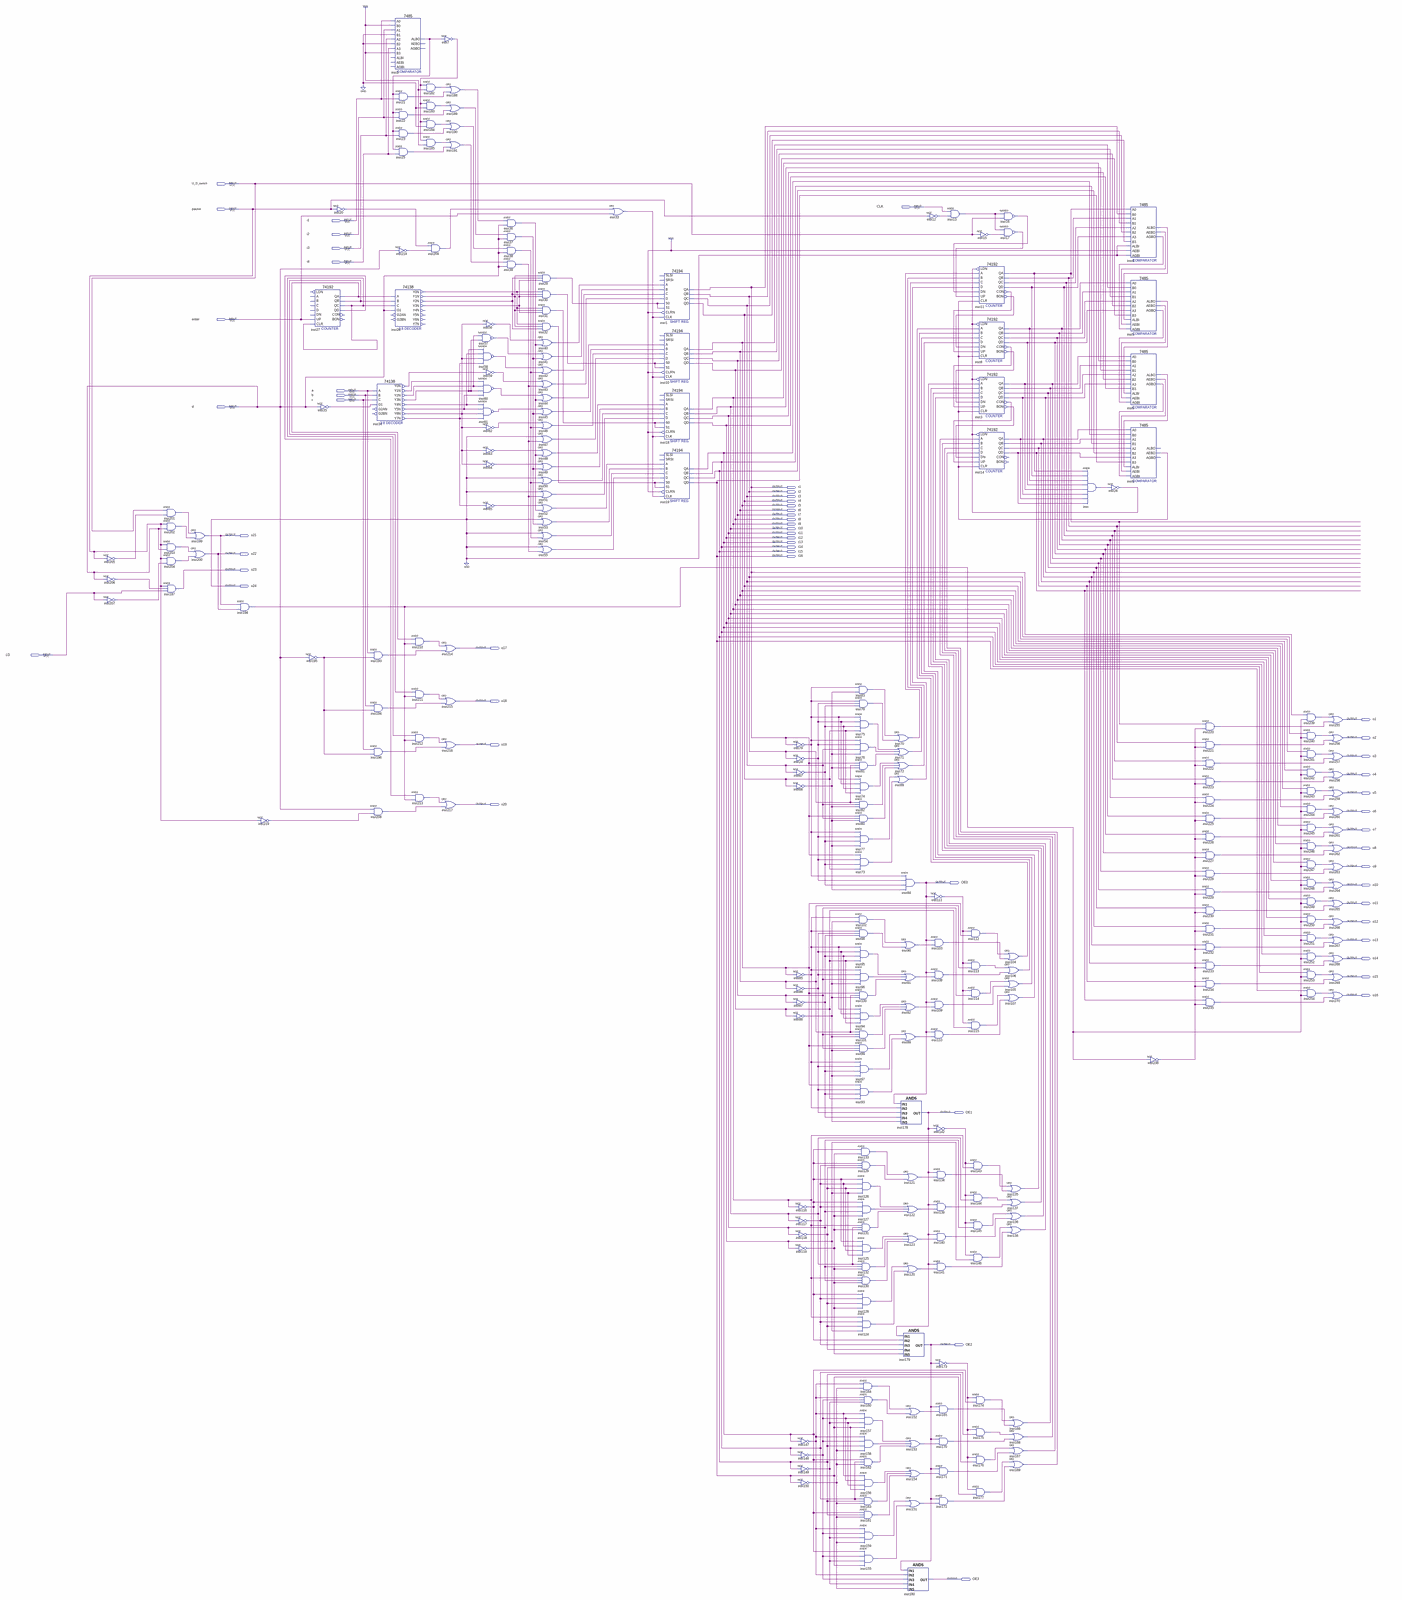
[diagram p0: schematic sheet, whole]
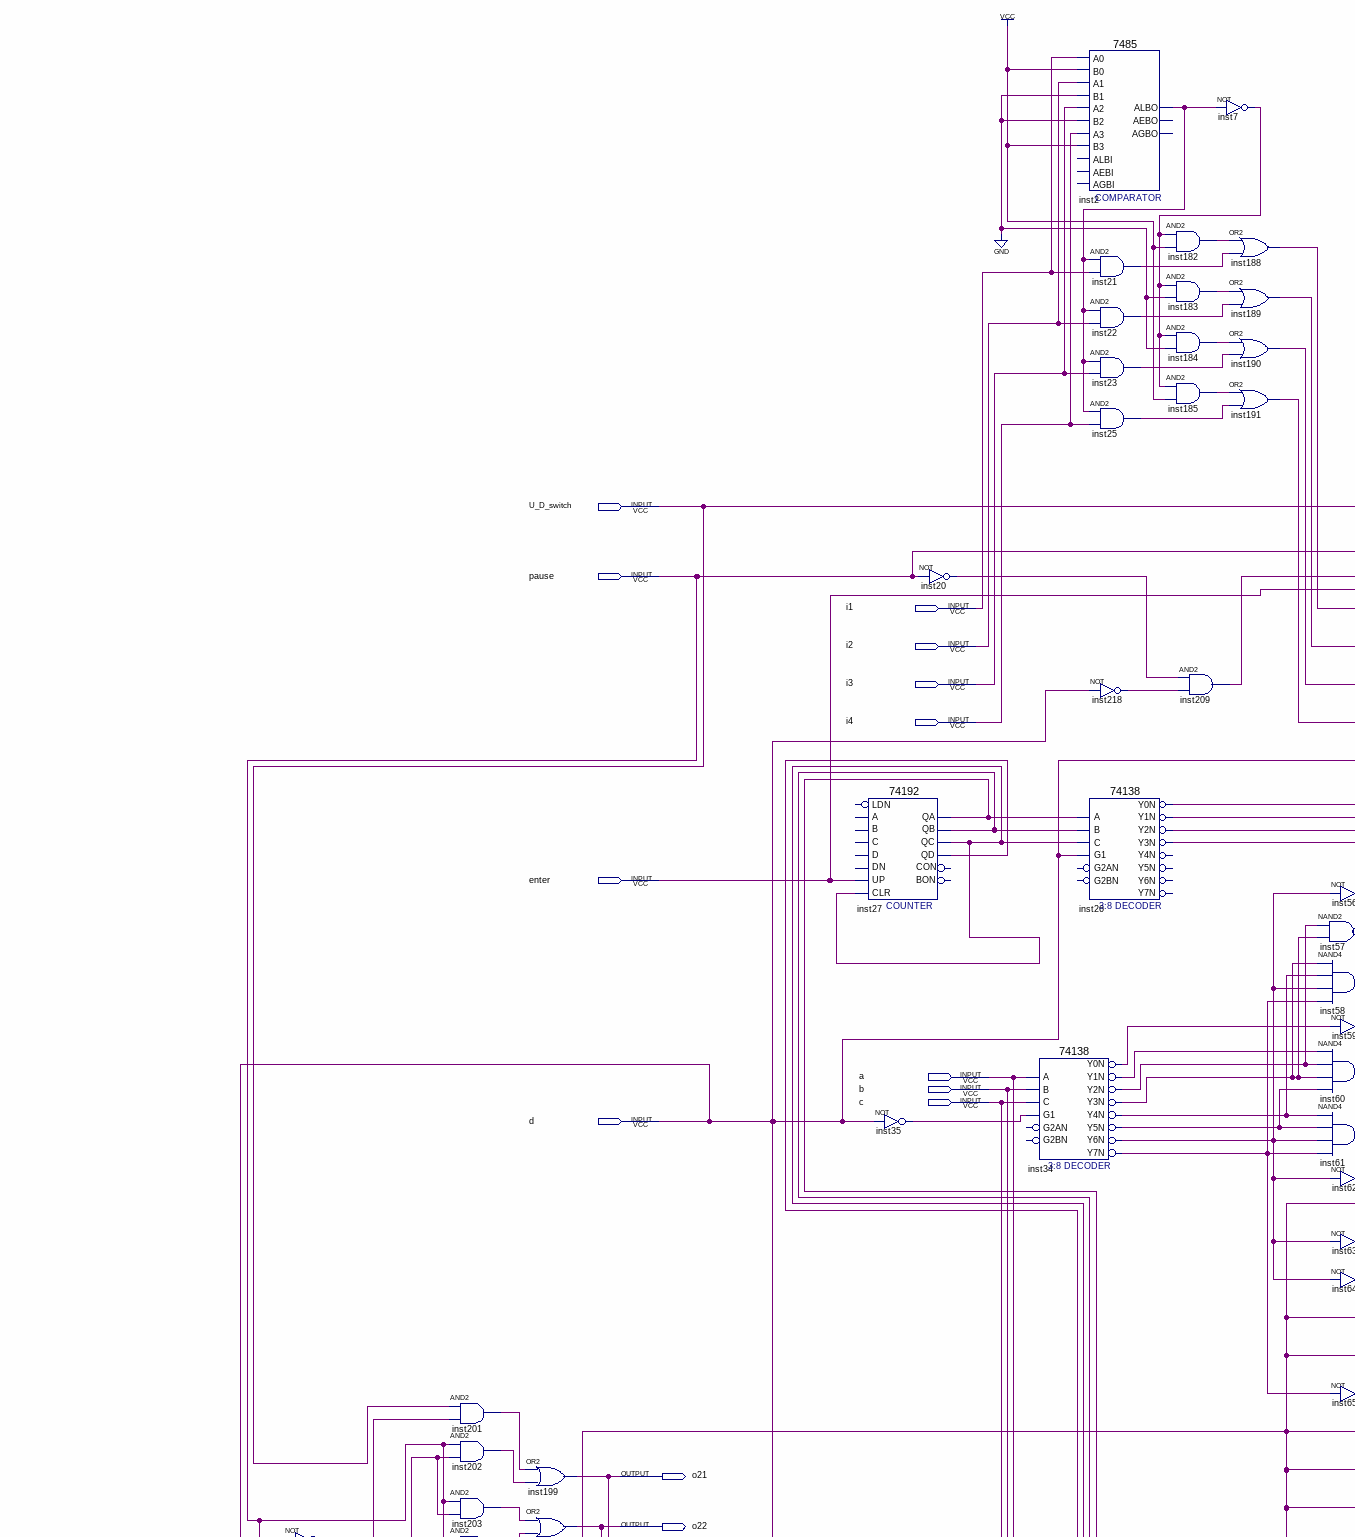
[diagram p1: schematic sheet, upper left part]
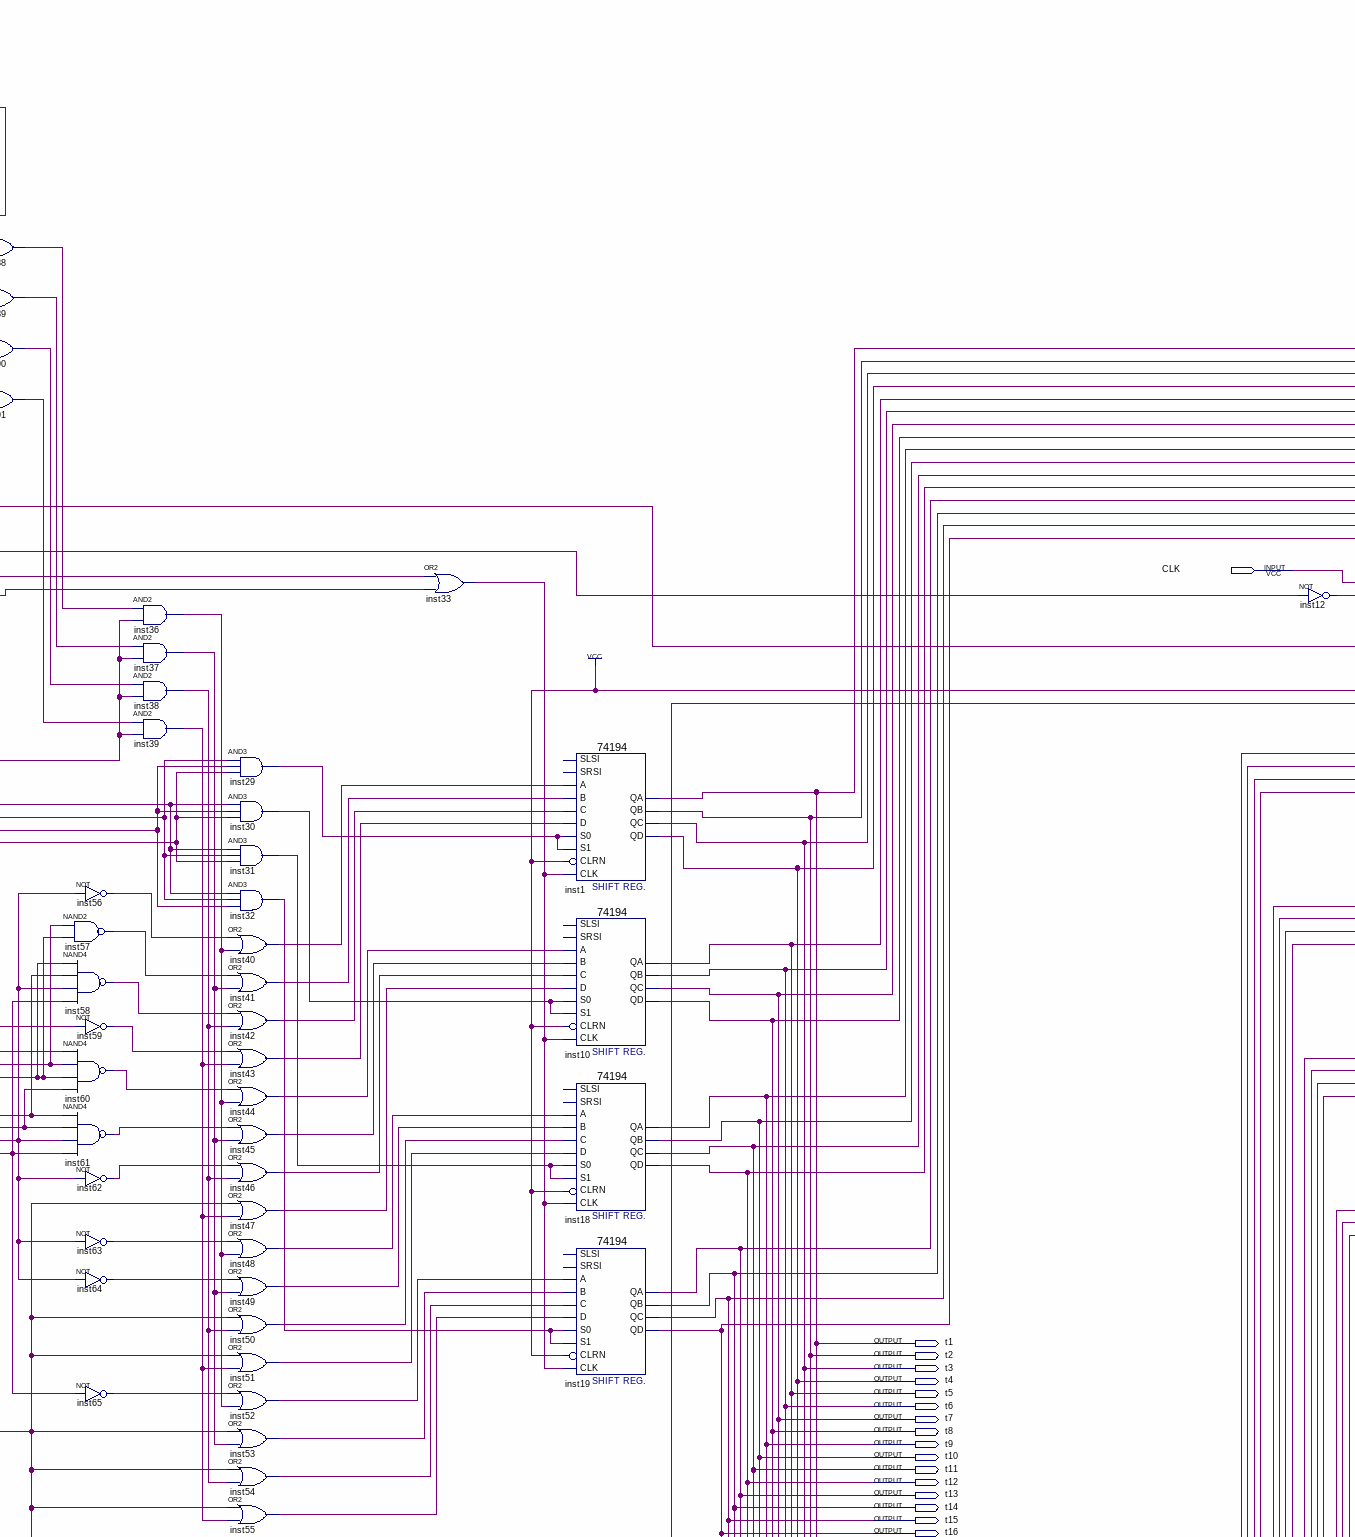
[diagram p2: schematic sheet, upper centre part]
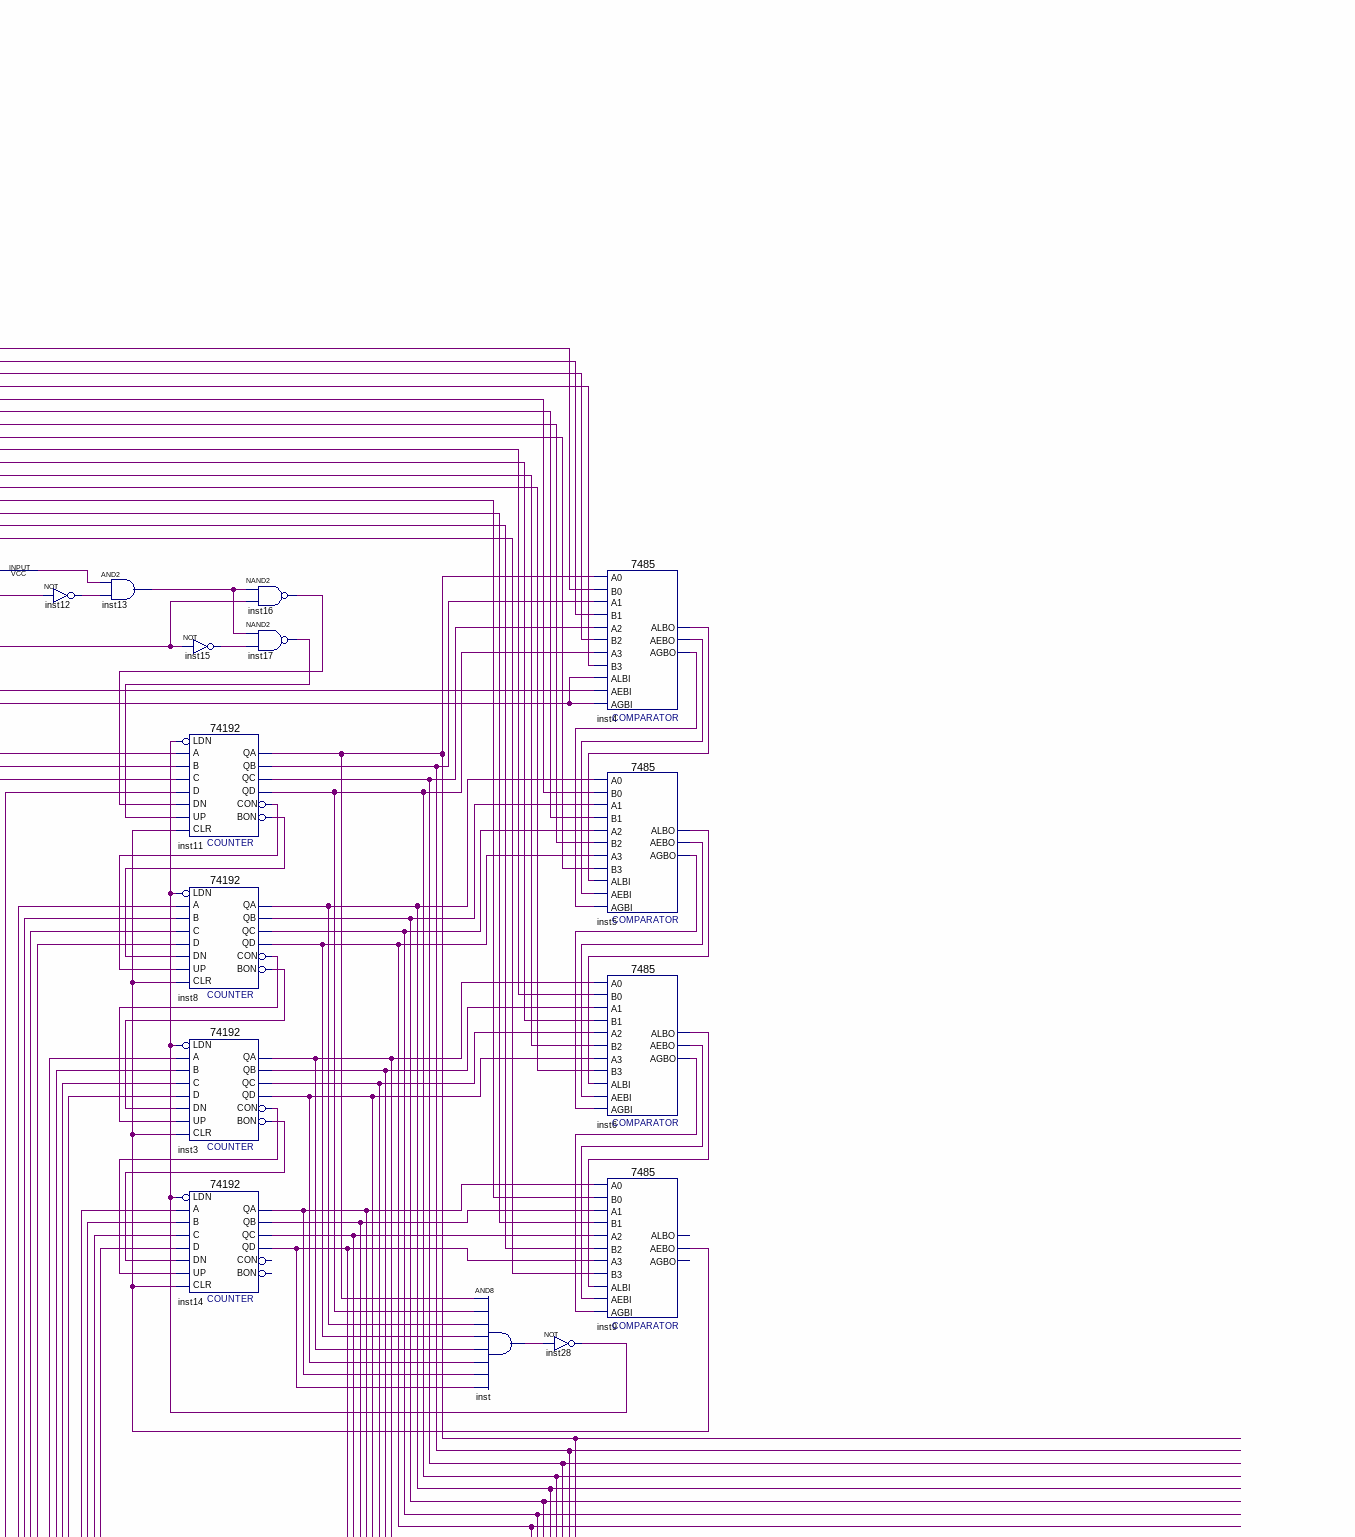
[diagram p3: schematic sheet, upper right part]
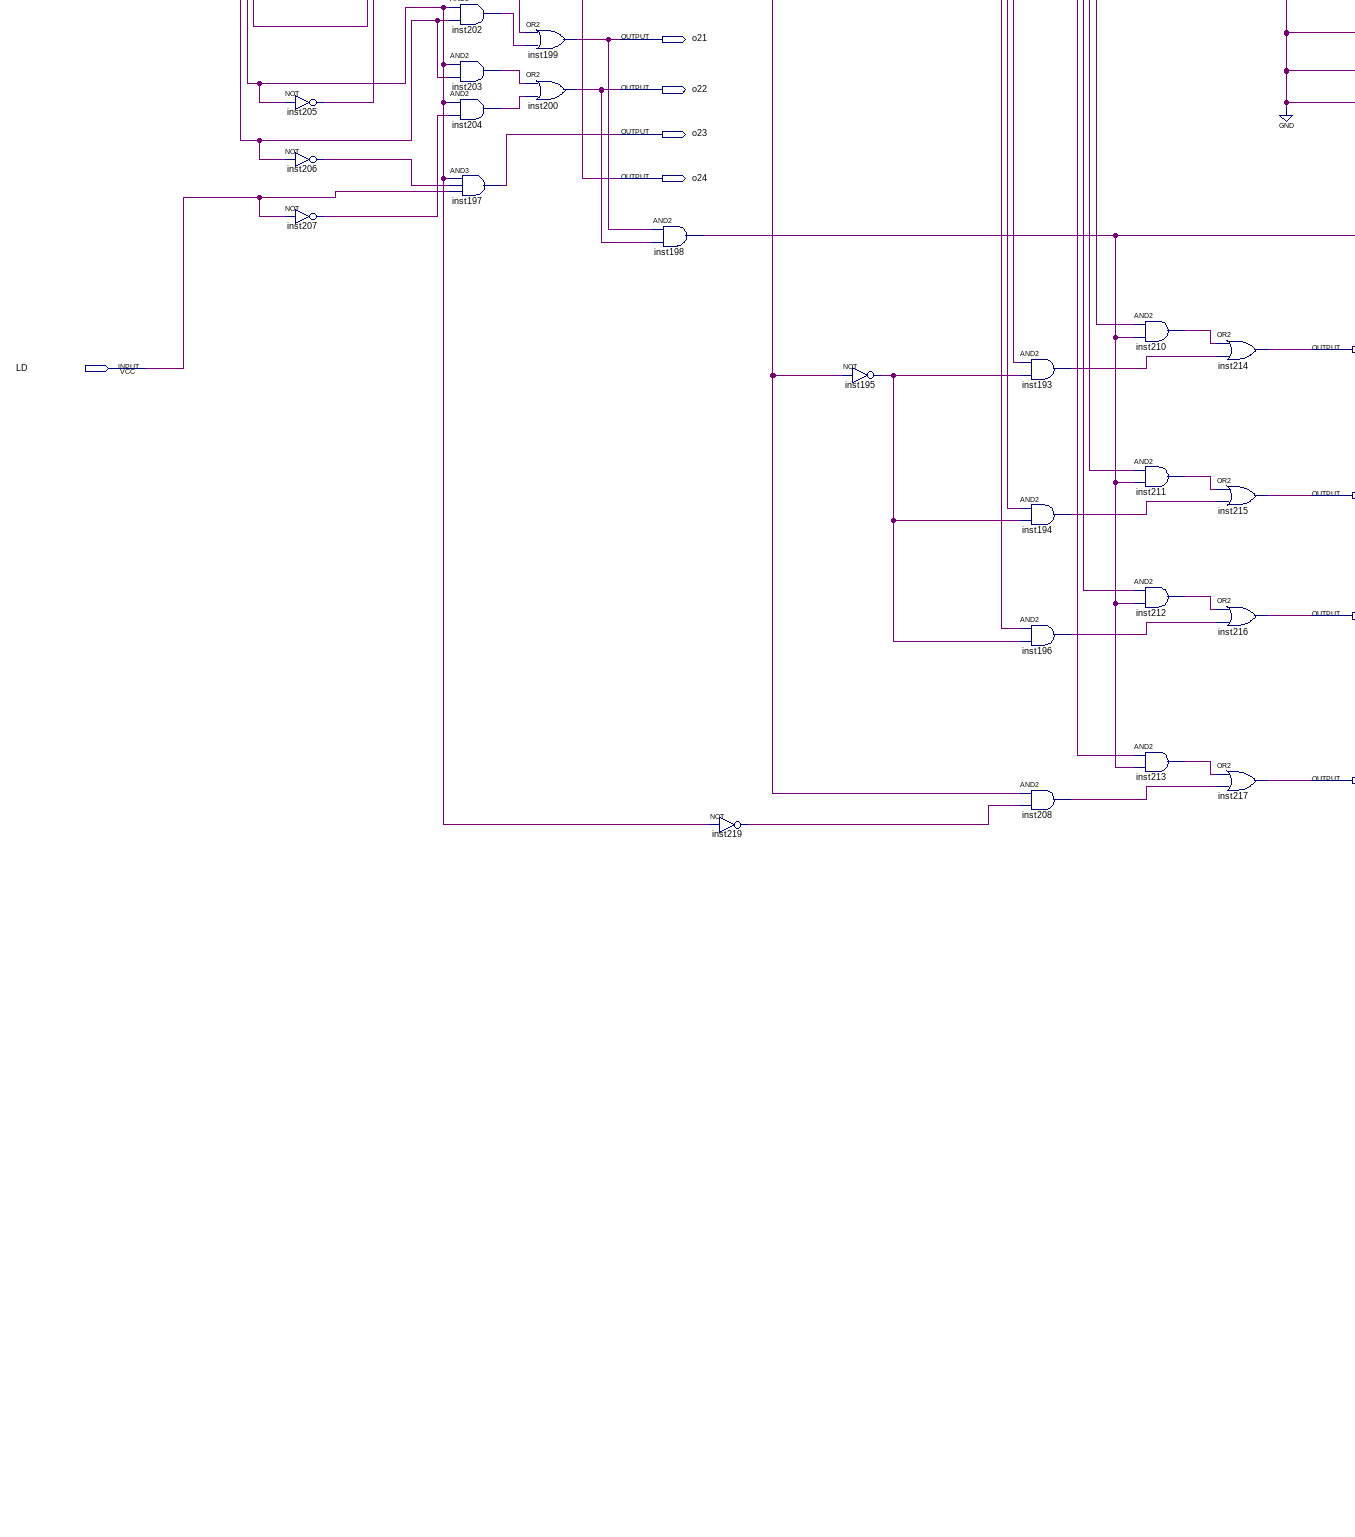
[diagram p4: schematic sheet, middle left part]
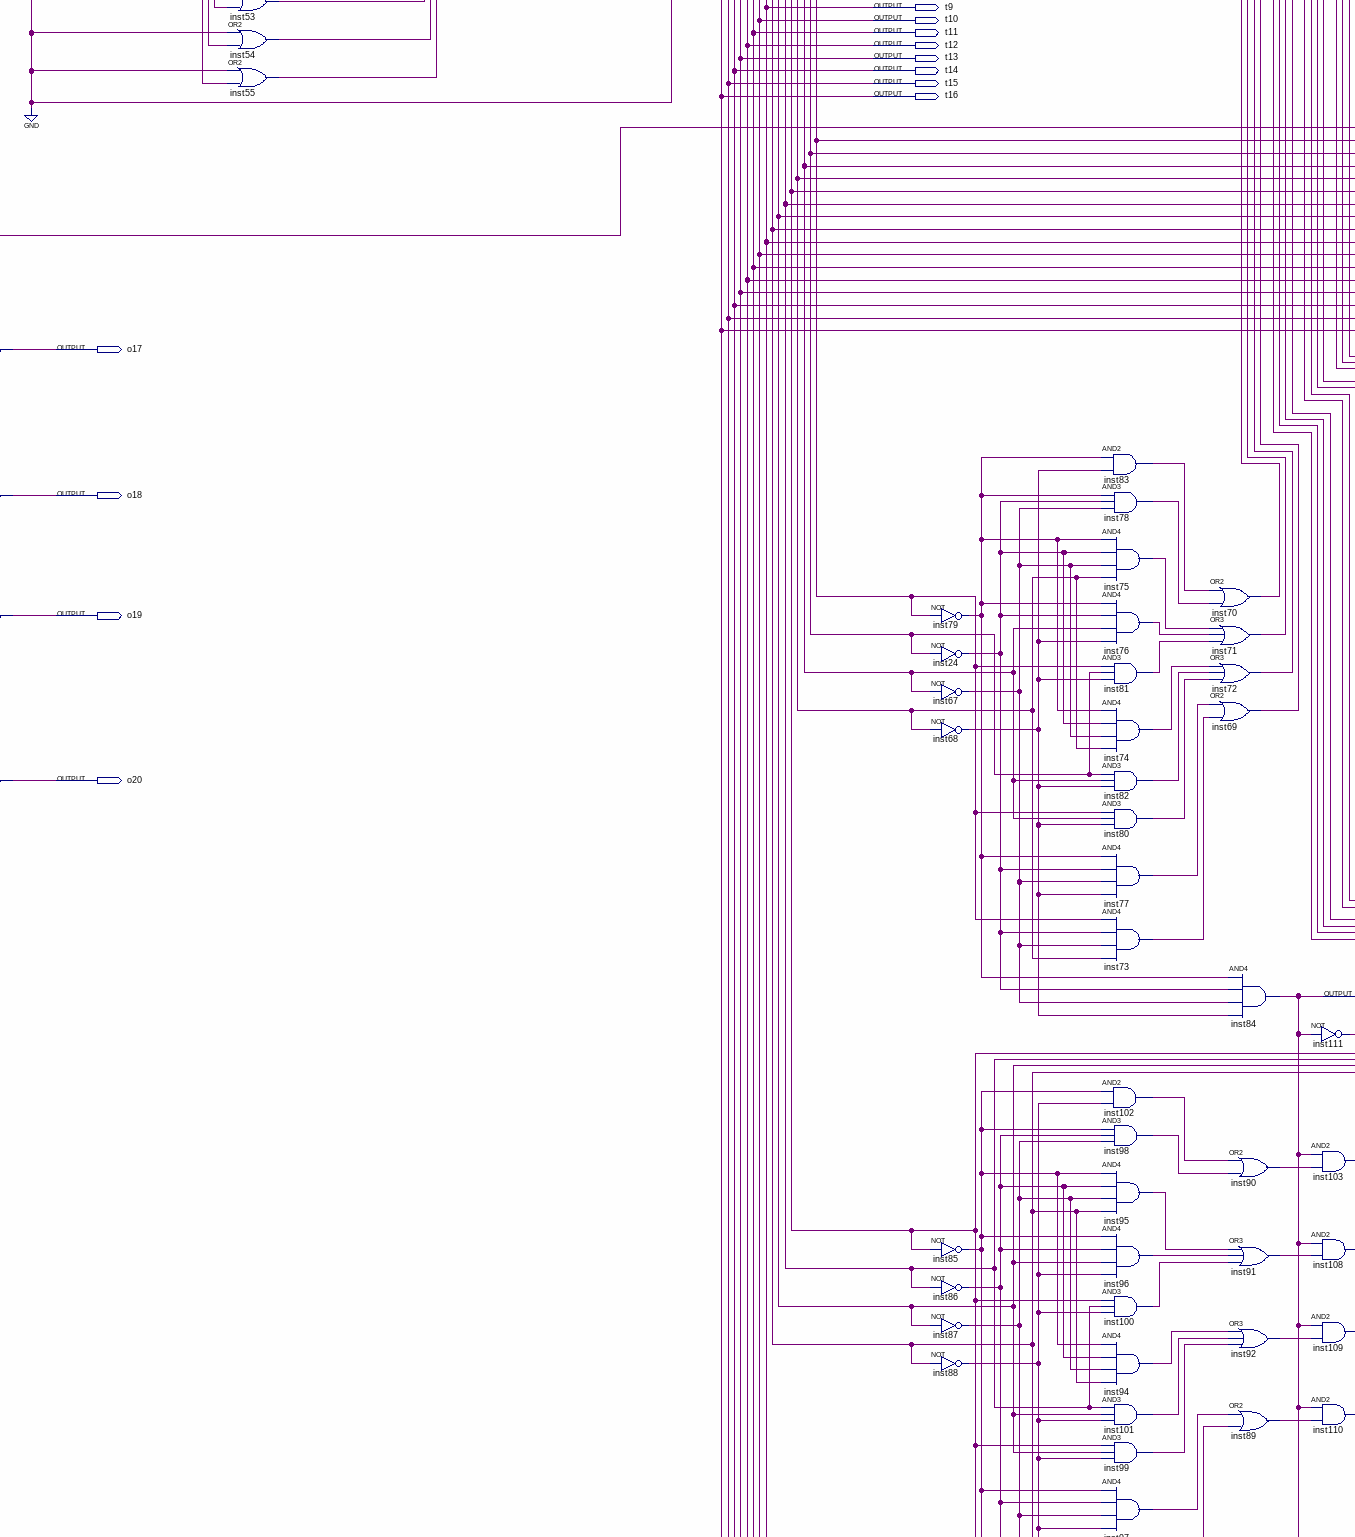
[diagram p5: schematic sheet, middle centre part]
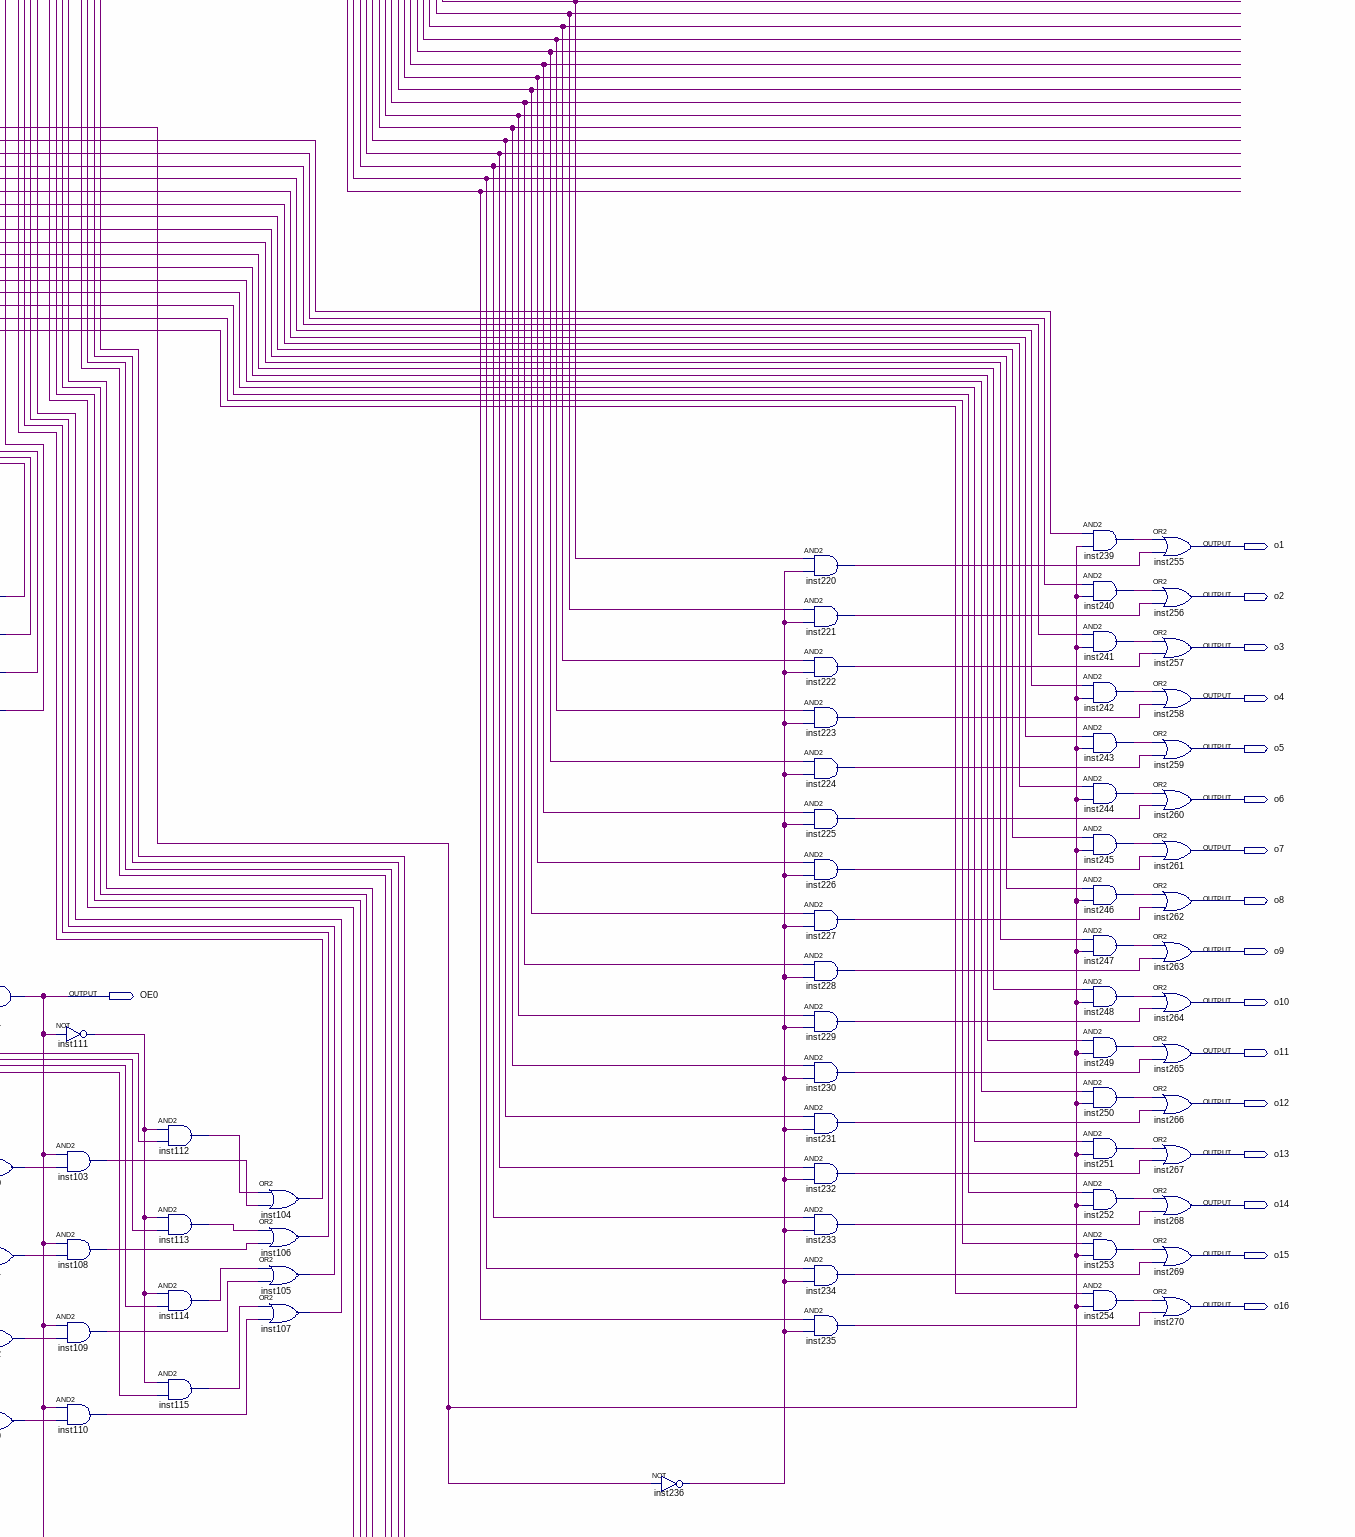
[diagram p6: schematic sheet, middle right part]
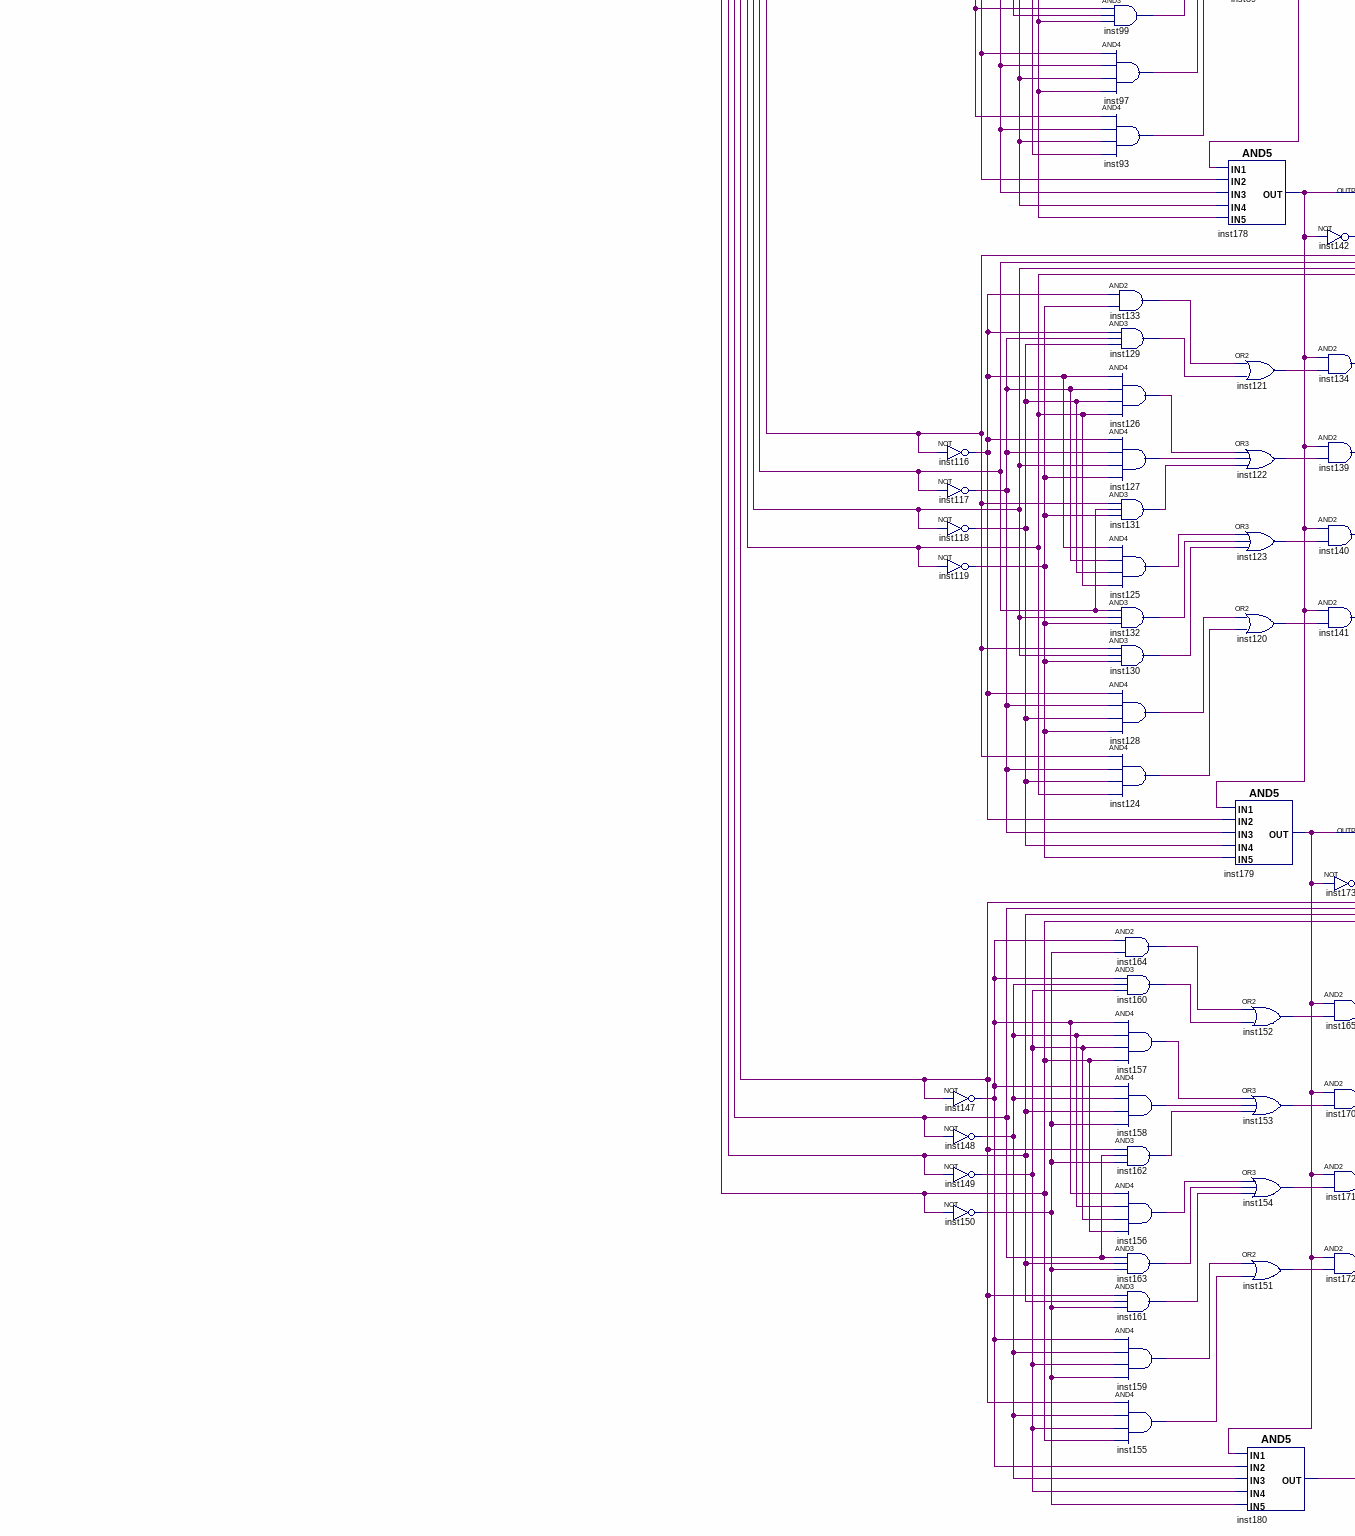
[diagram p7: schematic sheet, lower centre part]
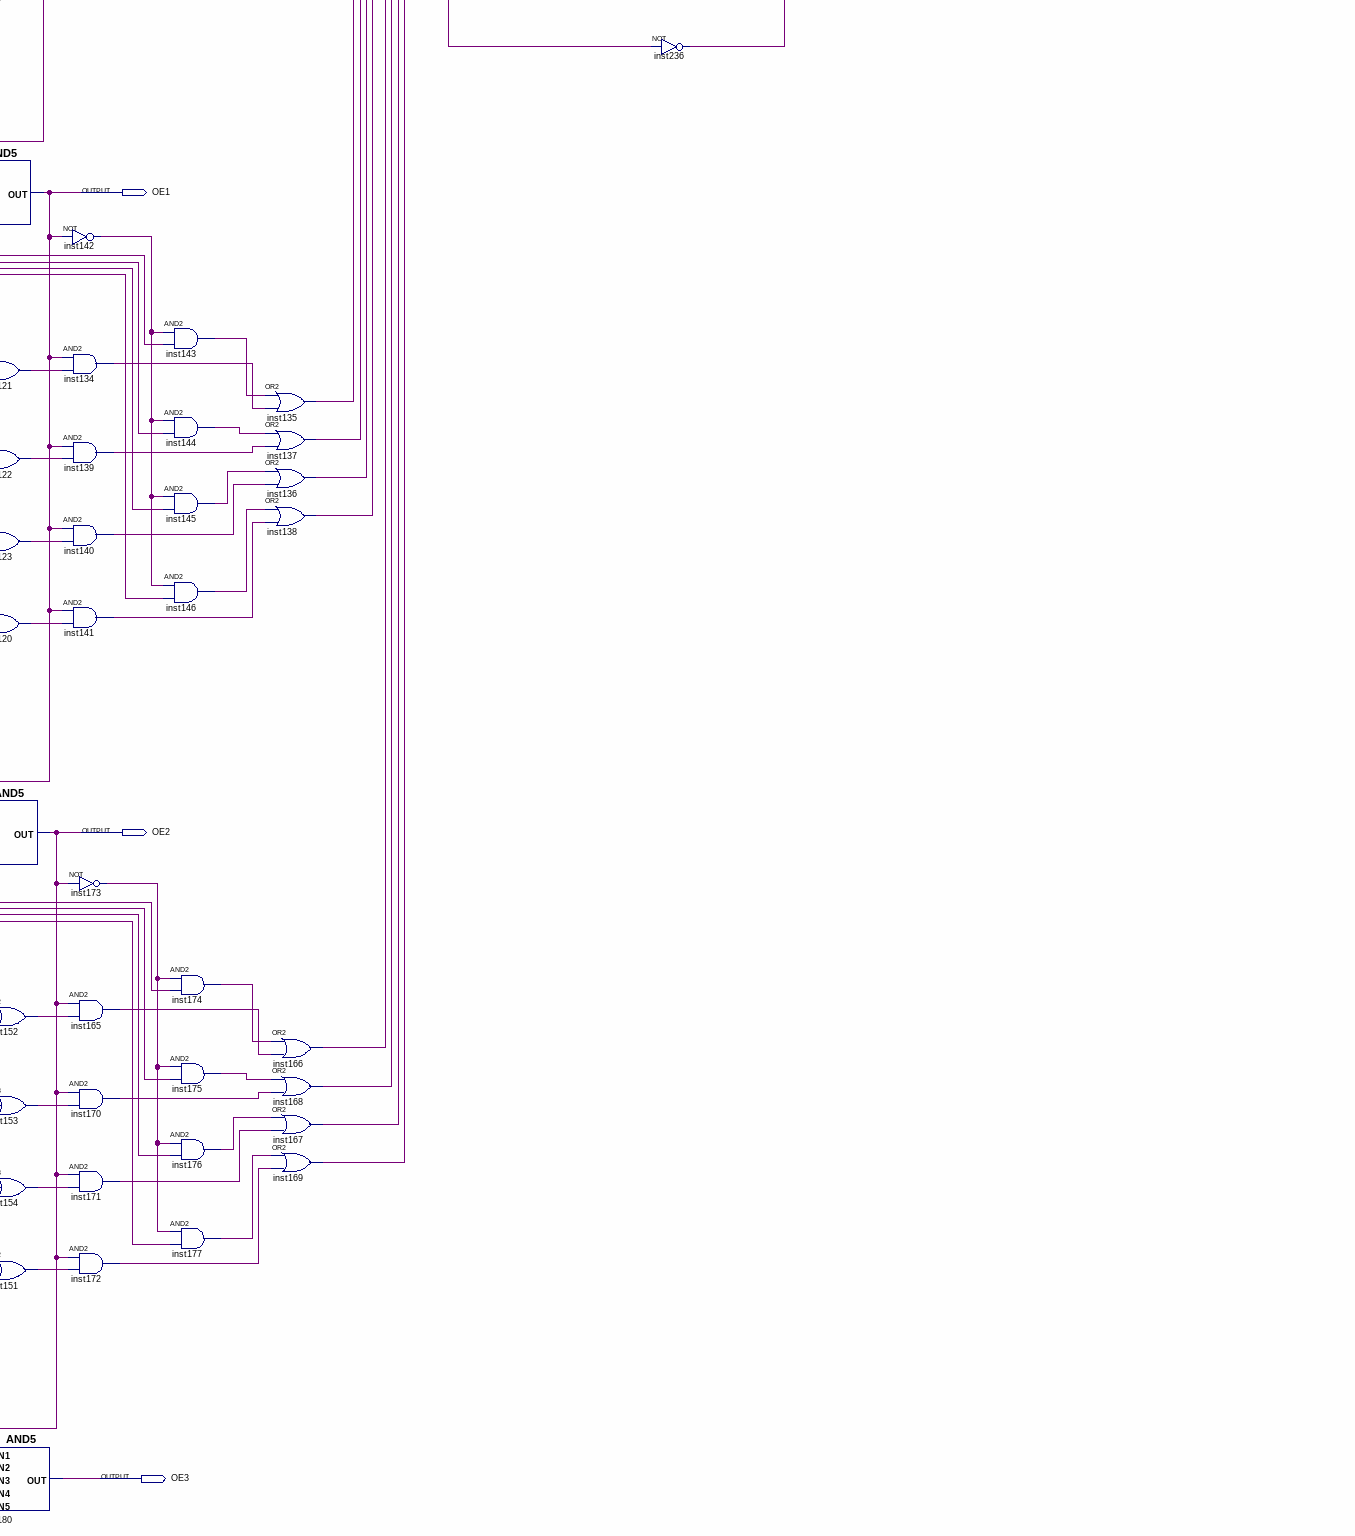
[diagram p8: schematic sheet, lower right part]
// Quartus schematic counter_v4.bdf as structural Verilog: 264 symbols, 57 pins
module counter_v4 (
  input  U_D_switch,
  input  CLK,
  input  pause,
  input  i1,
  input  i2,
  input  i3,
  input  i4,
  input  enter,
  input  a,
  input  b,
  input  c,
  input  d,
  input  LD,
  output t1,
  output t2,
  output t3,
  output t4,
  output t5,
  output t6,
  output t7,
  output t8,
  output t9,
  output t10,
  output t11,
  output o21,
  output t12,
  output t13,
  output t14,
  output t15,
  output o22,
  output t16,
  output o23,
  output o24,
  output o17,
  output o18,
  output o1,
  output o2,
  output o19,
  output o3,
  output o4,
  output o5,
  output o20,
  output o6,
  output o7,
  output o8,
  output o9,
  output OE0,
  output o10,
  output o11,
  output o12,
  output o13,
  output o14,
  output o15,
  output o16,
  output OE1,
  output OE2,
  output OE3
);

  wire inst2_albo, inst3_bon, inst3_con, inst3_qa, inst3_qb, inst3_qc, inst3_qd, inst4_aebo, inst4_agbo,
       inst4_albo, inst5_aebo, inst5_agbo, inst5_albo, inst6_aebo, inst6_agbo, inst6_albo, inst7_out,
       inst8_bon, inst8_con, inst8_qa, inst8_qb, inst8_qc, inst8_qd, inst9_aebo, inst11_bon, inst11_con,
       inst11_qa, inst11_qb, inst11_qc, inst11_qd, inst12_out, inst13_out, inst14_qa, inst14_qb, inst14_qc,
       inst14_qd, inst15_out, inst16_out, inst17_out, inst20_out, inst21_out, inst22_out, inst23_out,
       inst24_out, inst25_out, inst26_y0n, inst26_y1n, inst26_y2n, inst26_y3n, inst27_qa, inst27_qb,
       inst27_qc, inst27_qd, inst28_out, inst29_out, inst30_out, inst31_out, inst32_out, inst33_out,
       inst34_y0n, inst34_y1n, inst34_y2n, inst34_y3n, inst34_y4n, inst34_y5n, inst34_y6n, inst34_y7n,
       inst35_out, inst36_out, inst37_out, inst38_out, inst39_out, inst40_out, inst41_out, inst42_out,
       inst43_out, inst44_out, inst45_out, inst46_out, inst47_out, inst48_out, inst49_out, inst50_out,
       inst51_out, inst52_out, inst53_out, inst54_out, inst55_out, inst56_out, inst57_out, inst58_out,
       inst59_out, inst60_out, inst61_out, inst62_out, inst63_out, inst64_out, inst65_out, inst67_out,
       inst68_out, inst69_out, inst70_out, inst71_out, inst72_out, inst73_out, inst74_out, inst75_out,
       inst76_out, inst77_out, inst78_out, inst79_out, inst80_out, inst81_out, inst82_out, inst83_out,
       inst85_out, inst86_out, inst87_out, inst88_out, inst89_out, inst90_out, inst91_out, inst92_out,
       inst93_out, inst94_out, inst95_out, inst96_out, inst97_out, inst98_out, inst99_out, inst100_out,
       inst101_out, inst102_out, inst103_out, inst104_out, inst105_out, inst106_out, inst107_out,
       inst108_out, inst109_out, inst110_out, inst111_out, inst112_out, inst113_out, inst114_out,
       inst115_out, inst116_out, inst117_out, inst118_out, inst119_out, inst120_out, inst121_out,
       inst122_out, inst123_out, inst124_out, inst125_out, inst126_out, inst127_out, inst128_out,
       inst129_out, inst130_out, inst131_out, inst132_out, inst133_out, inst134_out, inst135_out,
       inst136_out, inst137_out, inst138_out, inst139_out, inst140_out, inst141_out, inst142_out,
       inst143_out, inst144_out, inst145_out, inst146_out, inst147_out, inst148_out, inst149_out,
       inst150_out, inst151_out, inst152_out, inst153_out, inst154_out, inst155_out, inst156_out,
       inst157_out, inst158_out, inst159_out, inst160_out, inst161_out, inst162_out, inst163_out,
       inst164_out, inst165_out, inst166_out, inst167_out, inst168_out, inst169_out, inst170_out,
       inst171_out, inst172_out, inst173_out, inst174_out, inst175_out, inst176_out, inst177_out,
       inst182_out, inst183_out, inst184_out, inst185_out, inst188_out, inst189_out, inst190_out,
       inst191_out, inst193_out, inst194_out, inst195_out, inst196_out, inst198_out, inst201_out,
       inst202_out, inst203_out, inst204_out, inst205_out, inst206_out, inst207_out, inst208_out,
       inst209_out, inst210_out, inst211_out, inst212_out, inst213_out, inst218_out, inst219_out,
       inst220_out, inst221_out, inst222_out, inst223_out, inst224_out, inst225_out, inst226_out,
       inst227_out, inst228_out, inst229_out, inst230_out, inst231_out, inst232_out, inst233_out,
       inst234_out, inst235_out, inst236_out, inst239_out, inst240_out, inst241_out, inst242_out,
       inst243_out, inst244_out, inst245_out, inst246_out, inst247_out, inst248_out, inst249_out,
       inst250_out, inst251_out, inst252_out, inst253_out, inst254_out, inst_out;

  not inst205 (inst205_out, pause);
  not inst206 (inst206_out, d);
  not inst207 (inst207_out, LD);
  and inst201 (inst201_out, U_D_switch, inst205_out);
  and inst202 (inst202_out, pause, d);
  and inst203 (inst203_out, pause, d);
  and inst204 (inst204_out, pause, inst207_out);
  and inst197 (o23, pause, inst206_out, LD);
  or inst199 (o21, inst201_out, inst202_out);
  or inst200 (o22, inst203_out, inst204_out);
  and inst198 (inst198_out, o21, o22);
  not inst219 (inst219_out, pause);
  \74192  inst27 (
    .CLR(inst27_qc), .UP(enter), .QB(inst27_qb), .QA(inst27_qa), .QC(inst27_qc), .QD(inst27_qd));  // open: D, C, A, B, DN, LDN, BON, CON
  not inst195 (inst195_out, d);
  not inst20 (inst20_out, pause);
  not inst35 (inst35_out, d);
  and inst193 (inst193_out, a, inst195_out);
  and inst194 (inst194_out, b, inst195_out);
  and inst196 (inst196_out, c, inst195_out);
  and inst208 (inst208_out, d, inst219_out);
  \74138  inst34 (
    .A(a), .B(b), .G1(inst35_out), .C(c), .Y0N(inst34_y0n), .Y1N(inst34_y1n), .Y2N(inst34_y2n),
    .Y3N(inst34_y3n), .Y4N(inst34_y4n), .Y5N(inst34_y5n), .Y6N(inst34_y6n), .Y7N(inst34_y7n));  // open: G2AN, G2BN
  \7485  inst2 (
    .A3(i4), .B2(1'b0), .A2(i3), .A0(i1), .B0(1'b1), .B3(1'b1), .A1(i2), .B1(1'b0), .ALBO(inst2_albo));  // open: AEBI, AGBI, ALBI, AGBO, AEBO
  and inst21 (inst21_out, inst2_albo, i1);
  and inst22 (inst22_out, inst2_albo, i2);
  and inst23 (inst23_out, inst2_albo, i3);
  and inst25 (inst25_out, inst2_albo, i4);
  not inst218 (inst218_out, d);
  \74138  inst26 (
    .A(inst27_qa), .B(inst27_qb), .G1(d), .C(inst27_qc), .Y0N(inst26_y0n), .Y1N(inst26_y1n),
    .Y2N(inst26_y2n), .Y3N(inst26_y3n));  // open: G2AN, G2BN, Y4N, Y5N, Y6N, Y7N
  and inst182 (inst182_out, inst7_out, 1'b1);
  and inst183 (inst183_out, inst7_out, 1'b0);
  and inst184 (inst184_out, inst7_out, 1'b0);
  and inst185 (inst185_out, inst7_out, 1'b1);
  and inst210 (inst210_out, inst27_qa, inst198_out);
  and inst211 (inst211_out, inst27_qb, inst198_out);
  and inst212 (inst212_out, inst27_qc, inst198_out);
  and inst213 (inst213_out, inst27_qd, inst198_out);
  not inst7 (inst7_out, inst2_albo);
  and inst209 (inst209_out, inst20_out, inst218_out);
  or inst214 (o17, inst210_out, inst193_out);
  or inst215 (o18, inst211_out, inst194_out);
  or inst216 (o19, inst212_out, inst196_out);
  or inst217 (o20, inst213_out, inst208_out);
  or inst188 (inst188_out, inst182_out, inst21_out);
  or inst189 (inst189_out, inst183_out, inst22_out);
  or inst190 (inst190_out, inst184_out, inst23_out);
  or inst191 (inst191_out, inst185_out, inst25_out);
  nand inst57 (inst57_out, inst34_y2n, inst34_y3n);
  nand inst58 (inst58_out, inst34_y3n, inst34_y4n, inst34_y6n, inst34_y7n);
  nand inst60 (inst60_out, inst34_y1n, inst34_y2n, inst34_y3n, inst34_y5n);
  nand inst61 (inst61_out, inst34_y4n, inst34_y5n, inst34_y6n, inst34_y7n);
  not inst56 (inst56_out, inst34_y6n);
  not inst59 (inst59_out, inst34_y0n);
  not inst62 (inst62_out, inst34_y6n);
  not inst63 (inst63_out, inst34_y6n);
  not inst64 (inst64_out, inst34_y6n);
  not inst65 (inst65_out, inst34_y7n);
  and inst36 (inst36_out, inst188_out, d);
  and inst37 (inst37_out, inst189_out, d);
  and inst38 (inst38_out, inst190_out, d);
  and inst39 (inst39_out, inst191_out, d);
  and inst29 (inst29_out, inst26_y1n, inst26_y2n, inst26_y3n);
  and inst30 (inst30_out, inst26_y0n, inst26_y2n, inst26_y3n);
  and inst31 (inst31_out, inst26_y0n, inst26_y1n, inst26_y3n);
  and inst32 (inst32_out, inst26_y0n, inst26_y1n, inst26_y2n);
  or inst40 (inst40_out, inst56_out, inst36_out);
  or inst41 (inst41_out, inst57_out, inst37_out);
  or inst42 (inst42_out, inst58_out, inst38_out);
  or inst43 (inst43_out, inst59_out, inst39_out);
  or inst44 (inst44_out, inst60_out, inst36_out);
  or inst45 (inst45_out, inst61_out, inst37_out);
  or inst46 (inst46_out, inst62_out, inst38_out);
  or inst47 (inst47_out, 1'b0, inst39_out);
  or inst48 (inst48_out, inst63_out, inst36_out);
  or inst49 (inst49_out, inst64_out, inst37_out);
  or inst50 (inst50_out, 1'b0, inst38_out);
  or inst51 (inst51_out, 1'b0, inst39_out);
  or inst52 (inst52_out, inst65_out, inst36_out);
  or inst53 (inst53_out, 1'b0, inst37_out);
  or inst54 (inst54_out, 1'b0, inst38_out);
  or inst55 (inst55_out, 1'b0, inst39_out);
  or inst33 (inst33_out, inst209_out, enter);
  \74194  inst1 (
    .B(inst41_out), .C(inst42_out), .CLK(inst33_out), .CLRN(1'b1), .D(inst43_out), .S1(inst29_out),
    .S0(inst29_out), .A(inst40_out), .QA(t1), .QB(t2), .QC(t3), .QD(t4));  // open: SLSI, SRSI
  \74194  inst10 (
    .B(inst45_out), .C(inst46_out), .CLK(inst33_out), .CLRN(1'b1), .D(inst47_out), .S1(inst30_out),
    .S0(inst30_out), .A(inst44_out), .QA(t5), .QB(t6), .QC(t7), .QD(t8));  // open: SLSI, SRSI
  \74194  inst18 (
    .B(inst49_out), .C(inst50_out), .CLK(inst33_out), .CLRN(1'b1), .D(inst51_out), .S1(inst31_out),
    .S0(inst31_out), .A(inst48_out), .QA(t9), .QB(t10), .QC(t11), .QD(t12));  // open: SLSI, SRSI
  \74194  inst19 (
    .B(inst53_out), .C(inst54_out), .CLK(inst33_out), .CLRN(1'b1), .D(inst55_out), .S1(inst32_out),
    .S0(inst32_out), .A(inst52_out), .QA(t13), .QB(t14), .QC(t15), .QD(t16));  // open: SLSI, SRSI
  not inst79 (inst79_out, t1);
  not inst24 (inst24_out, t2);
  not inst67 (inst67_out, t3);
  not inst68 (inst68_out, t4);
  not inst85 (inst85_out, t5);
  not inst86 (inst86_out, t6);
  not inst87 (inst87_out, t7);
  not inst88 (inst88_out, t8);
  not inst116 (inst116_out, t9);
  not inst117 (inst117_out, t10);
  not inst118 (inst118_out, t11);
  not inst119 (inst119_out, t12);
  not inst147 (inst147_out, t13);
  not inst148 (inst148_out, t14);
  not inst149 (inst149_out, t15);
  not inst150 (inst150_out, t16);
  and inst83 (inst83_out, inst79_out, inst68_out);
  and inst78 (inst78_out, inst79_out, inst24_out, inst67_out);
  and inst75 (inst75_out, inst79_out, inst24_out, inst67_out, t4);
  and inst76 (inst76_out, inst79_out, inst24_out, t3, inst68_out);
  and inst81 (inst81_out, t1, t2, inst68_out);
  and inst74 (inst74_out, inst79_out, inst24_out, inst67_out, t4);
  and inst82 (inst82_out, t2, t3, inst68_out);
  and inst80 (inst80_out, t1, t3, inst68_out);
  and inst77 (inst77_out, inst79_out, inst24_out, inst67_out, inst68_out);
  and inst73 (inst73_out, t1, inst24_out, inst67_out, t4);
  and inst102 (inst102_out, inst85_out, inst88_out);
  and inst98 (inst98_out, inst85_out, inst86_out, inst87_out);
  and inst95 (inst95_out, inst85_out, inst86_out, inst87_out, t8);
  and inst96 (inst96_out, inst85_out, inst86_out, t7, inst88_out);
  and inst100 (inst100_out, t5, t6, inst88_out);
  and inst94 (inst94_out, inst85_out, inst86_out, inst87_out, t8);
  and inst101 (inst101_out, t6, t7, inst88_out);
  and inst99 (inst99_out, t5, t7, inst88_out);
  and inst97 (inst97_out, inst85_out, inst86_out, inst87_out, inst88_out);
  and inst93 (inst93_out, t5, inst86_out, inst87_out, t8);
  and inst133 (inst133_out, inst116_out, inst119_out);
  and inst129 (inst129_out, inst116_out, inst117_out, inst118_out);
  and inst126 (inst126_out, inst116_out, inst117_out, inst118_out, t12);
  and inst127 (inst127_out, inst116_out, inst117_out, t11, inst119_out);
  and inst131 (inst131_out, t9, t10, inst119_out);
  and inst125 (inst125_out, inst116_out, inst117_out, inst118_out, t12);
  and inst132 (inst132_out, t10, t11, inst119_out);
  and inst130 (inst130_out, t9, t11, inst119_out);
  and inst128 (inst128_out, inst116_out, inst117_out, inst118_out, inst119_out);
  and inst124 (inst124_out, t9, inst117_out, inst118_out, t12);
  and inst164 (inst164_out, inst147_out, inst150_out);
  and inst160 (inst160_out, inst147_out, inst148_out, inst149_out);
  and inst157 (inst157_out, inst147_out, inst148_out, inst149_out, t16);
  and inst158 (inst158_out, inst147_out, inst148_out, t15, inst150_out);
  and inst162 (inst162_out, t13, t14, inst150_out);
  and inst156 (inst156_out, inst147_out, inst148_out, inst149_out, t16);
  and inst163 (inst163_out, t14, t15, inst150_out);
  and inst161 (inst161_out, t13, t15, inst150_out);
  and inst159 (inst159_out, inst147_out, inst148_out, inst149_out, inst150_out);
  and inst155 (inst155_out, t13, inst148_out, inst149_out, t16);
  or inst70 (inst70_out, inst83_out, inst78_out);
  or inst71 (inst71_out, inst75_out, inst76_out, inst81_out);
  or inst72 (inst72_out, inst74_out, inst82_out, inst80_out);
  or inst69 (inst69_out, inst77_out, inst73_out);
  and inst84 (OE0, inst79_out, inst24_out, inst67_out, inst68_out);
  or inst90 (inst90_out, inst102_out, inst98_out);
  or inst91 (inst91_out, inst95_out, inst96_out, inst100_out);
  or inst92 (inst92_out, inst94_out, inst101_out, inst99_out);
  or inst89 (inst89_out, inst97_out, inst93_out);
  and inst178 (OE1, OE0, inst85_out, inst86_out, inst87_out, inst88_out);
  or inst121 (inst121_out, inst133_out, inst129_out);
  or inst122 (inst122_out, inst126_out, inst127_out, inst131_out);
  or inst123 (inst123_out, inst125_out, inst132_out, inst130_out);
  or inst120 (inst120_out, inst128_out, inst124_out);
  and inst179 (OE2, OE1, inst116_out, inst117_out, inst118_out, inst119_out);
  and inst180 (OE3, OE2, inst147_out, inst148_out, inst149_out, inst150_out);
  or inst152 (inst152_out, inst164_out, inst160_out);
  or inst153 (inst153_out, inst157_out, inst158_out, inst162_out);
  or inst154 (inst154_out, inst156_out, inst163_out, inst161_out);
  or inst151 (inst151_out, inst159_out, inst155_out);
  not inst12 (inst12_out, pause);
  not inst111 (inst111_out, OE0);
  and inst103 (inst103_out, OE0, inst90_out);
  and inst108 (inst108_out, OE0, inst91_out);
  and inst109 (inst109_out, OE0, inst92_out);
  and inst110 (inst110_out, OE0, inst89_out);
  not inst142 (inst142_out, OE1);
  and inst134 (inst134_out, OE1, inst121_out);
  and inst139 (inst139_out, OE1, inst122_out);
  and inst140 (inst140_out, OE1, inst123_out);
  and inst141 (inst141_out, OE1, inst120_out);
  not inst173 (inst173_out, OE2);
  and inst165 (inst165_out, OE2, inst152_out);
  and inst170 (inst170_out, OE2, inst153_out);
  and inst171 (inst171_out, OE2, inst154_out);
  and inst172 (inst172_out, OE2, inst151_out);
  and inst13 (inst13_out, CLK, inst12_out);
  not inst15 (inst15_out, U_D_switch);
  \74192  inst11 (
    .D(inst69_out), .C(inst72_out), .A(inst70_out), .B(inst71_out), .CLR(inst9_aebo), .UP(inst17_out),
    .DN(inst16_out), .LDN(inst28_out), .QB(inst11_qb), .BON(inst11_bon), .CON(inst11_con), .QA(inst11_qa),
    .QC(inst11_qc), .QD(inst11_qd));
  \74192  inst8 (
    .D(inst107_out), .C(inst105_out), .A(inst104_out), .B(inst106_out), .CLR(inst9_aebo), .UP(inst11_con),
    .DN(inst11_bon), .LDN(inst28_out), .QB(inst8_qb), .BON(inst8_bon), .CON(inst8_con), .QA(inst8_qa),
    .QC(inst8_qc), .QD(inst8_qd));
  \74192  inst3 (
    .D(inst138_out), .C(inst136_out), .A(inst135_out), .B(inst137_out), .CLR(inst9_aebo), .UP(inst8_con),
    .DN(inst8_bon), .LDN(inst28_out), .QB(inst3_qb), .BON(inst3_bon), .CON(inst3_con), .QA(inst3_qa),
    .QC(inst3_qc), .QD(inst3_qd));
  \74192  inst14 (
    .D(inst169_out), .C(inst167_out), .A(inst166_out), .B(inst168_out), .CLR(inst9_aebo), .UP(inst3_con),
    .DN(inst3_bon), .LDN(inst28_out), .QB(inst14_qb), .QA(inst14_qa), .QC(inst14_qc), .QD(inst14_qd));  // open: BON, CON
  and inst112 (inst112_out, inst111_out, t5);
  and inst113 (inst113_out, inst111_out, t6);
  and inst114 (inst114_out, inst111_out, t7);
  and inst115 (inst115_out, inst111_out, t8);
  and inst143 (inst143_out, inst142_out, t9);
  and inst144 (inst144_out, inst142_out, t10);
  and inst145 (inst145_out, inst142_out, t11);
  and inst146 (inst146_out, inst142_out, t12);
  and inst174 (inst174_out, inst173_out, t13);
  and inst175 (inst175_out, inst173_out, t14);
  and inst176 (inst176_out, inst173_out, t15);
  and inst177 (inst177_out, inst173_out, t16);
  nand inst16 (inst16_out, inst13_out, U_D_switch);
  nand inst17 (inst17_out, inst13_out, inst15_out);
  or inst104 (inst104_out, inst112_out, inst103_out);
  or inst106 (inst106_out, inst113_out, inst108_out);
  or inst105 (inst105_out, inst114_out, inst109_out);
  or inst107 (inst107_out, inst115_out, inst110_out);
  or inst135 (inst135_out, inst143_out, inst134_out);
  or inst137 (inst137_out, inst144_out, inst139_out);
  or inst136 (inst136_out, inst145_out, inst140_out);
  or inst138 (inst138_out, inst146_out, inst141_out);
  or inst166 (inst166_out, inst174_out, inst165_out);
  or inst168 (inst168_out, inst175_out, inst170_out);
  or inst167 (inst167_out, inst176_out, inst171_out);
  or inst169 (inst169_out, inst177_out, inst172_out);
  and inst (inst_out, inst11_qa, inst11_qd, inst8_qa, inst8_qd, inst3_qa, inst3_qd, inst14_qa, inst14_qd);
  not inst28 (inst28_out, inst_out);
  \7485  inst4 (
    .A3(inst11_qd), .B2(t3), .A2(inst11_qc), .AEBI(1'b1), .AGBI(1'b0), .ALBI(1'b0), .A0(inst11_qa), .B0(t1),
    .B3(t4), .A1(inst11_qb), .B1(t2), .ALBO(inst4_albo), .AGBO(inst4_agbo), .AEBO(inst4_aebo));
  \7485  inst5 (
    .A3(inst8_qd), .B2(t7), .A2(inst8_qc), .AEBI(inst4_aebo), .AGBI(inst4_agbo), .ALBI(inst4_albo),
    .A0(inst8_qa), .B0(t5), .B3(t8), .A1(inst8_qb), .B1(t6), .ALBO(inst5_albo), .AGBO(inst5_agbo),
    .AEBO(inst5_aebo));
  \7485  inst6 (
    .A3(inst3_qd), .B2(t11), .A2(inst3_qc), .AEBI(inst5_aebo), .AGBI(inst5_agbo), .ALBI(inst5_albo),
    .A0(inst3_qa), .B0(t9), .B3(t12), .A1(inst3_qb), .B1(t10), .ALBO(inst6_albo), .AGBO(inst6_agbo),
    .AEBO(inst6_aebo));
  \7485  inst9 (
    .A3(inst14_qd), .B2(t15), .A2(inst14_qc), .AEBI(inst6_aebo), .AGBI(inst6_agbo), .ALBI(inst6_albo),
    .A0(inst14_qa), .B0(t13), .B3(t16), .A1(inst14_qb), .B1(t14), .AEBO(inst9_aebo));  // open: ALBO, AGBO
  not inst236 (inst236_out, inst198_out);
  and inst220 (inst220_out, inst11_qa, inst236_out);
  and inst221 (inst221_out, inst11_qb, inst236_out);
  and inst222 (inst222_out, inst11_qc, inst236_out);
  and inst223 (inst223_out, inst11_qd, inst236_out);
  and inst224 (inst224_out, inst8_qa, inst236_out);
  and inst225 (inst225_out, inst8_qb, inst236_out);
  and inst226 (inst226_out, inst8_qc, inst236_out);
  and inst227 (inst227_out, inst8_qd, inst236_out);
  and inst228 (inst228_out, inst3_qa, inst236_out);
  and inst229 (inst229_out, inst3_qb, inst236_out);
  and inst230 (inst230_out, inst3_qc, inst236_out);
  and inst231 (inst231_out, inst3_qd, inst236_out);
  and inst232 (inst232_out, inst14_qa, inst236_out);
  and inst233 (inst233_out, inst14_qb, inst236_out);
  and inst234 (inst234_out, inst14_qc, inst236_out);
  and inst235 (inst235_out, inst14_qd, inst236_out);
  and inst239 (inst239_out, t1, inst198_out);
  and inst240 (inst240_out, t2, inst198_out);
  and inst241 (inst241_out, t3, inst198_out);
  and inst242 (inst242_out, t4, inst198_out);
  and inst243 (inst243_out, t5, inst198_out);
  and inst244 (inst244_out, t6, inst198_out);
  and inst245 (inst245_out, t7, inst198_out);
  and inst246 (inst246_out, t8, inst198_out);
  and inst247 (inst247_out, t9, inst198_out);
  and inst248 (inst248_out, t10, inst198_out);
  and inst249 (inst249_out, t11, inst198_out);
  and inst250 (inst250_out, t12, inst198_out);
  and inst251 (inst251_out, t13, inst198_out);
  and inst252 (inst252_out, t14, inst198_out);
  and inst253 (inst253_out, t15, inst198_out);
  and inst254 (inst254_out, t16, inst198_out);
  or inst255 (o1, inst239_out, inst220_out);
  or inst256 (o2, inst240_out, inst221_out);
  or inst257 (o3, inst241_out, inst222_out);
  or inst258 (o4, inst242_out, inst223_out);
  or inst259 (o5, inst243_out, inst224_out);
  or inst260 (o6, inst244_out, inst225_out);
  or inst261 (o7, inst245_out, inst226_out);
  or inst262 (o8, inst246_out, inst227_out);
  or inst263 (o9, inst247_out, inst228_out);
  or inst264 (o10, inst248_out, inst229_out);
  or inst265 (o11, inst249_out, inst230_out);
  or inst266 (o12, inst250_out, inst231_out);
  or inst267 (o13, inst251_out, inst232_out);
  or inst268 (o14, inst252_out, inst233_out);
  or inst269 (o15, inst253_out, inst234_out);
  or inst270 (o16, inst254_out, inst235_out);

  assign o24 = 1'b0;
endmodule
